# Altium project CW308T-FE310-G002.PrjPcb
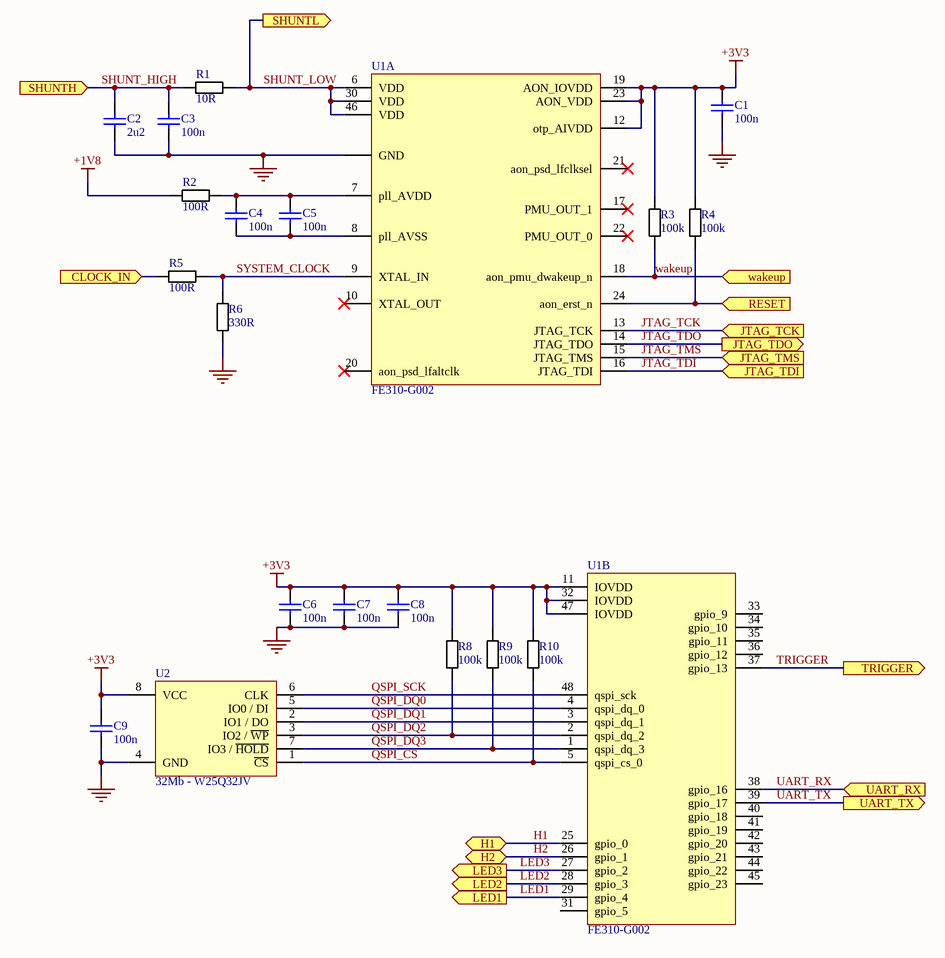
[diagram p0: CW308T-FE310-G002.SchDoc]
PrjLicense: GPL; PrjName: FE310-G002 Target; PrjRev: 02
2 sheets, 21 parts. Net scope: flat (ports and power ports of the same name join across sheets).
Board files: CW308T-FE310-G002.PcbDoc, FE310-G002-PANEL.PcbDoc
Sheets:
  CW308T-FE310-G002.SchDoc
  CW308T-FE310-G002-CONN.SchDoc

## Sheet CW308T-FE310-G002.SchDoc: FE310-G002 MCU and SPI
size Letter; SheetNumber: 1; SheetTotal: 2; SheetApproved: Yes

### Parts
C1  100n  [CAPC0603_M]
C2  2u2  [CAPC0603_M]
C3  100n  [CAPC0603_M]
C4  100n  [CAPC0603_M]
C5  100n  [CAPC0603_M]
C6  100n  [CAPC0603_M]
C7  100n  [CAPC0603_M]
C8  100n  [CAPC0603_M]
C9  100n  [CAPC0603_M]
R1  10R  [RESC1608X55N]
R2  100R  [RESC1608X55N]
R3  100k  [RESC1608X55N]
R4  100k  [RESC1608X55N]
R5  100R  [RESC1608X55N]
R6  330R  [RESC1608X55N]
R8  100k  [RESC1608X55N]
R9  100k  [RESC1608X55N]
R10  100k  [RESC1608X55N]
U1  FE310-G002  [QFN40P600X600X95_HS-49N]  (parts A,B of 2)
U2  32Mb - W25Q32JV  [SOIC127P790X216-8N]

### Ports
CLOCK_IN (in), H1 (bidir), H2 (bidir), JTAG_TCK (in), JTAG_TDI (in), JTAG_TDO (out), JTAG_TMS (in), LED1 (out), LED2 (out), LED3 (out), RESET (in), SHUNTH (in), SHUNTL (out), TRIGGER (out), UART_RX (in), UART_TX (out), wakeup (in)

### Nets
+1V8: R2.1
+3V3: C1.1 C6.1 C7.1 C8.1 C9.1 R3.1 R4.1 R8.1 R9.1 R10.1 U1.11(IOVDD) U1.12(otp_AIVDD) U1.19(AON_IOVDD) U1.23(AON_VDD) U1.32(IOVDD) U1.47(IOVDD) U2.8(VCC)
GND: C1.2 C2.2 C3.2 C6.2 C7.2 C8.2 C9.2 R6.2 U1.PAD(GND) U2.4(GND)
H1: U1.25(gpio_0) ; port H1
H2: U1.26(gpio_1) ; port H2
JTAG_TCK: U1.13(JTAG_TCK) ; port JTAG_TCK
JTAG_TDI: U1.16(JTAG_TDI) ; port JTAG_TDI
JTAG_TDO: U1.14(JTAG_TDO) ; port JTAG_TDO
JTAG_TMS: U1.15(JTAG_TMS) ; port JTAG_TMS
LED1: U1.29(gpio_4) ; port LED1
LED2: U1.28(gpio_3) ; port LED2
LED3: U1.27(gpio_2) ; port LED3
QSPI_CS: R10.2 U1.5(qspi_cs_0) U2.1(~{CS})
QSPI_DQ0: U1.4(qspi_dq_0) U2.5(IO0_/_DI)
QSPI_DQ1: U1.3(qspi_dq_1) U2.2(IO1_/_DO)
QSPI_DQ2: R8.2 U1.2(qspi_dq_2) U2.3(IO2_/_~{WP})
QSPI_DQ3: R9.2 U1.1(qspi_dq_3) U2.7(IO3_/_~{HOLD})
QSPI_SCK: U1.48(qspi_sck) U2.6(CLK)
RESET: R4.2 U1.24(aon_erst_n) ; port RESET
SHUNT_HIGH: C2.1 C3.1 R1.1 ; port SHUNTH
SHUNT_LOW: R1.2 U1.6(VDD) U1.30(VDD) U1.46(VDD) ; port SHUNTL
SYSTEM_CLOCK: R5.2 R6.1 U1.9(XTAL_IN)
TRIGGER: U1.37(gpio_13) ; port TRIGGER
UART_RX: U1.38(gpio_16) ; port UART_RX
UART_TX: U1.39(gpio_17) ; port UART_TX
wakeup: R3.2 U1.18(aon_pmu_dwakeup_n) ; port wakeup
NetC4_1: C4.1 C5.1 R2.2 U1.7(pll_AVDD)
NetC4_2: C4.2 C5.2 U1.8(pll_AVSS)
NetJ1_A3: R5.1 ; port CLOCK_IN

Not connected (* = marked no-connect by the designer): U1 10(XTAL_OUT)* 17(PMU_OUT_1)* 20(aon_psd_lfaltclk)* 21(aon_psd_lfclksel)* 22(PMU_OUT_0)* 31(gpio_5) 33(gpio_9) 34(gpio_10) 35(gpio_11) 36(gpio_12) 40(gpio_18) 41(gpio_19) 42(gpio_20) 43(gpio_21) 44(gpio_22) 45(gpio_23)

### Notes on the sheet
- Title:
- Date:
- Rev:
- Time:
- Project:
- Sheet
- of
- License:
- Copyright © NewAE Technology Inc.
- Approved:
- NewAE.com
- File:

### Library data of the parts
C1 C3-C9 = CCHIP-100n-0603: 100n, 0603; Manufacture 1: Kemet; Manufacture Part Number 1: C0603C104K5RACTU; Component Group: Capacitor; Case-EIA: 0603; Case-Metric: 1608; Rated Voltage: 50VDC; Part Number: CCHIP-100n-0603; Footprint: 0603; Pin Count: 2; Supplier 1: Digi-Key; Supplier Part Number 1: 399-5089-2-ND; Value: 100n; Mounting Technology: SMT; Component Kind: Standard; Component Type: Standard
C2 = CCHIP-2u2-0603: 2u2, 0603; Manufacture 1: Samsung; Manufacture Part Number 1: CL10B225KP8NNNC; Component Group: Capacitor; Case-EIA: 0603; Case-Metric: 1608; Rated Voltage: 10VDC; Part Number: CCHIP-2u2-0603; Footprint: 0603; Pin Count: 2; Supplier 1: Digi-Key; Supplier Part Number 1: 1276-1134-2-ND; Value: 2u2; Mounting Technology: SMT; Component Kind: Standard; Component Type: Standard
R1 = RCHIP-10R-0603: 10R res, 0603, 1%, 1/10W; Manufacture 1: Yageo; Manufacture Part Number 1: RC0603FR-0710RL; Component Group: Resistor; Case-EIA: 0603; Case-Metric: 1608; Rated Power: 0.1W; Rated Voltage: 75VDC; Part Number: RCHIP-10R-0603; Footprint: 0603; Pin Count: 2; Supplier 1: Digi-Key; Supplier Part Number 1: 311-10.0HRCT-ND; Value: 10R; Tolerance: 1%; Mounting Technology: SMT; Temperature Range: -55C to 155C; Component Kind: Standard; Component Type: Standard
R2 R5 = RCHIP-100R-0603: 100R res, 0603, 1%, 1/10W; Manufacture 1: Yageo; Manufacture Part Number 1: RC0603FR-07100RL; Component Group: Resistor; Case-EIA: 0603; Case-Metric: 1608; Rated Power: 0.1W; Rated Voltage: 75VDC; Part Number: RCHIP-100R-0603; Footprint: 0603; Pin Count: 2; Supplier 1: Digi-Key; Supplier Part Number 1: 311-100HRCT-ND; Value: 100R; Tolerance: 1%; Mounting Technology: SMT; Temperature Range: -55C to 155C; Component Kind: Standard; Component Type: Standard
R3 R4 R8-R10 = RCHIP-100K-0603: 100k res, 0603, 1%, 1/10W; Manufacture 1: Yageo; Manufacture Part Number 1: RC0603FR-07100KL; Component Group: Resistor; Case-EIA: 0603; Case-Metric: 1608; Rated Power: 0.1W; Rated Voltage: 75VDC; Part Number: RCHIP-100K-0603; Footprint: 0603; Pin Count: 2; Supplier 1: Digi-Key; Supplier Part Number 1: 311-100KHRCT-ND; Value: 100k; Tolerance: 1%; Mounting Technology: SMT; Temperature Range: -55C to 155C; Component Kind: Standard; Component Type: Standard
R6 = RCHIP-330R-0603: 330R res, 0603, 1%, 1/10W; Manufacture 1: Yageo; Manufacture Part Number 1: RC0603FR-07330RL; Component Group: Resistor; Case-EIA: 0603; Case-Metric: 1608; Rated Power: 0.1W; Rated Voltage: 75VDC; Part Number: RCHIP-330R-0603; Footprint: 0603; Pin Count: 2; Supplier 1: Digi-Key; Supplier Part Number 1: 311-330HRCT-ND; Value: 330R; Tolerance: 1%; Mounting Technology: SMT; Temperature Range: -55C to 155C; Component Kind: Standard; Component Type: Standard
U1 = FE310-G002: RISC-V FREEDOM SoC; Manufacture 1: SiFive; Component Group: Digital IC; PP Material Stack: 0; Part Number: FE310-G002; Footprint: QFN-48; Manufacture Part Number 1: FE310-G002; Pin Count: 48; Mounting Technology: SMT; Component Kind: Standard; Component Type: Standard; PP Rotation: 0
U2 = QSPI-FLASH-32M-32Mb: IC FLASH 32M SPI 133MHZ 8SOIC; Manufacture 1: Winbond Electronics; Manufacture Part Number 1: W25Q32JVSSIQ TR; Component Group: Digital IC; PP Material Stack: 0; Part Number: QSPI-FLASH-32M-32Mb; Footprint: 8SOIC; Pin Count: 8; Supplier 1: Digi-Key; Supplier Part Number 1: W25Q32JVSSIQCT-ND; Value: 32Mb; Mounting Technology: SMT; RoHS: Yes; Component Kind: Standard; Component Type: Standard; PP Rotation: 0

## Sheet CW308T-FE310-G002-CONN.SchDoc: CW308 Connections
size Letter; SheetNumber: 2; SheetTotal: 2; SheetApproved: NO
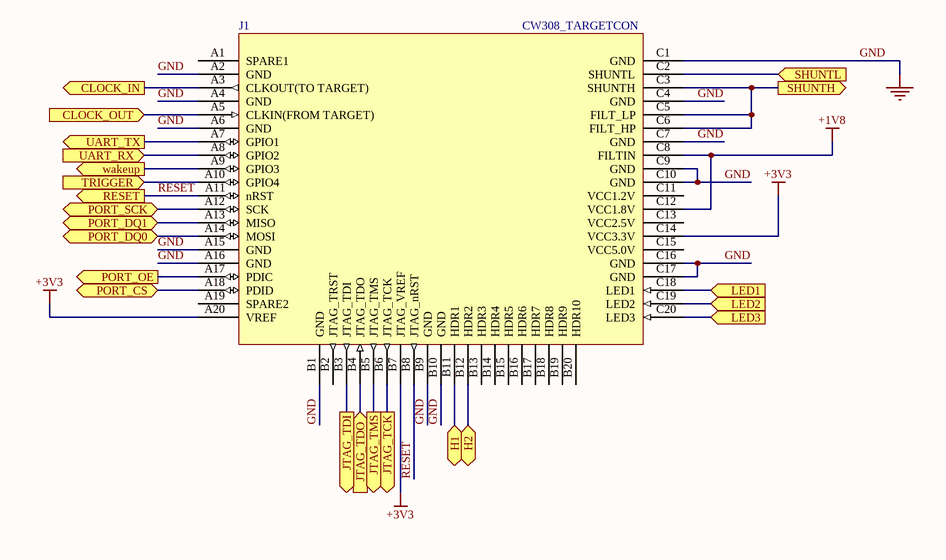
[diagram p1: CW308T-FE310-G002-CONN.SchDoc]

### Parts
J1  CW308_TARGETCON  [CW308_TBOARD_CONN]

### Ports
CLOCK_IN (out), CLOCK_OUT (in), H1 (bidir), H2 (bidir), JTAG_TCK (out), JTAG_TDI (out), JTAG_TDO (in), JTAG_TMS (out), LED1 (in), LED2 (in), LED3 (in), PORT_CS (bidir), PORT_DQ0 (bidir), PORT_DQ1 (bidir), PORT_OE (out), PORT_SCK (bidir), RESET (out), SHUNTH (out), SHUNTL (in), TRIGGER (in), UART_RX (in), UART_TX (out), wakeup (out)

### Nets
+1V8: J1.C8(FILTIN) J1.C12(VCC1.8V)
+3V3: J1.A20(VREF) J1.B7(JTAG_VREF) J1.C14(VCC3.3V)
GND: J1.A2(GND) J1.A4(GND) J1.A6(GND) J1.A15(GND) J1.A16(GND) J1.B1(GND) J1.B9(GND) J1.B10(GND) J1.C1(GND) J1.C4(GND) J1.C7(GND) J1.C9(GND) J1.C10(GND) J1.C16(GND) J1.C17(GND)
H1: J1.B11(HDR1) ; port H1
H2: J1.B12(HDR2) ; port H2
JTAG_TCK: J1.B6(JTAG_TCK) ; port JTAG_TCK
JTAG_TDI: J1.B3(JTAG_TDI) ; port JTAG_TDI
JTAG_TDO: J1.B4(JTAG_TDO) ; port JTAG_TDO
JTAG_TMS: J1.B5(JTAG_TMS) ; port JTAG_TMS
LED1: J1.C18(LED1) ; port LED1
LED2: J1.C19(LED2) ; port LED2
LED3: J1.C20(LED3) ; port LED3
RESET: J1.A11(nRST) J1.B8(JTAG_nRST) ; port RESET
SHUNT_HIGH: J1.C3(SHUNTH) J1.C5(FILT_LP) J1.C6(FILT_HP) ; port SHUNTH
SHUNT_LOW: J1.C2(SHUNTL) ; port SHUNTL
TRIGGER: J1.A10(GPIO4) ; port TRIGGER
UART_RX: J1.A8(GPIO2) ; port UART_RX
UART_TX: J1.A7(GPIO1) ; port UART_TX
wakeup: J1.A9(GPIO3) ; port wakeup
NetJ1_A3: J1.A3(CLKOUT(TO_TARGET)) ; port CLOCK_IN
NetJ1_A5: J1.A5(CLKIN(FROM_TARGET)) ; port CLOCK_OUT
NetJ1_A12: J1.A12(SCK) ; port PORT_SCK
NetJ1_A13: J1.A13(MISO) ; port PORT_DQ1
NetJ1_A14: J1.A14(MOSI) ; port PORT_DQ0
NetJ1_A17: J1.A17(PDIC) ; port PORT_OE
NetJ1_A18: J1.A18(PDID) ; port PORT_CS

Not connected (* = marked no-connect by the designer): J1 A1(SPARE1) A19(SPARE2) B2(JTAG_TRST) B13(HDR3) B14(HDR4) B15(HDR5) B16(HDR6) B17(HDR7) B18(HDR8) B19(HDR9) B20(HDR10) C11(VCC1.2V) C13(VCC2.5V) C15(VCC5.0V)

### Notes on the sheet
- Title:
- Date:
- Rev:
- Time:
- Project:
- Sheet
- of
- License:
- Copyright © NewAE Technology Inc.
- Approved:
- NewAE.com
- File:

### Library data of the parts
J1 = CW308_TBOARD: CW308 "Standard" Target Board Connector; Component Group: Mechanical; Pitch: 2.54mm; Part Number: CW308_TBOARD; Pin Count: 60; Mounting Technology: Through-hole; Component Kind: Standard; Component Type: Standard

## Nets that join several sheets
+1V8: CW308T-FE310-G002 (R2.1), CW308T-FE310-G002-CONN (J1.C8 J1.C12)
+3V3: CW308T-FE310-G002 (17 pins), CW308T-FE310-G002-CONN (J1.A20 J1.B7 J1.C14)
GND: CW308T-FE310-G002 (10 pins), CW308T-FE310-G002-CONN (15 pins)
H1: CW308T-FE310-G002 (U1.25), CW308T-FE310-G002-CONN (J1.B11)
H2: CW308T-FE310-G002 (U1.26), CW308T-FE310-G002-CONN (J1.B12)
JTAG_TCK: CW308T-FE310-G002 (U1.13), CW308T-FE310-G002-CONN (J1.B6)
JTAG_TDI: CW308T-FE310-G002 (U1.16), CW308T-FE310-G002-CONN (J1.B3)
JTAG_TDO: CW308T-FE310-G002 (U1.14), CW308T-FE310-G002-CONN (J1.B4)
JTAG_TMS: CW308T-FE310-G002 (U1.15), CW308T-FE310-G002-CONN (J1.B5)
LED1: CW308T-FE310-G002 (U1.29), CW308T-FE310-G002-CONN (J1.C18)
LED2: CW308T-FE310-G002 (U1.28), CW308T-FE310-G002-CONN (J1.C19)
LED3: CW308T-FE310-G002 (U1.27), CW308T-FE310-G002-CONN (J1.C20)
NetJ1_A3: CW308T-FE310-G002 (R5.1), CW308T-FE310-G002-CONN (J1.A3)
RESET: CW308T-FE310-G002 (R4.2 U1.24), CW308T-FE310-G002-CONN (J1.A11 J1.B8)
SHUNT_HIGH: CW308T-FE310-G002 (C2.1 C3.1 R1.1), CW308T-FE310-G002-CONN (J1.C3 J1.C5 J1.C6)
SHUNT_LOW: CW308T-FE310-G002 (R1.2 U1.6 U1.30 U1.46), CW308T-FE310-G002-CONN (J1.C2)
TRIGGER: CW308T-FE310-G002 (U1.37), CW308T-FE310-G002-CONN (J1.A10)
UART_RX: CW308T-FE310-G002 (U1.38), CW308T-FE310-G002-CONN (J1.A8)
UART_TX: CW308T-FE310-G002 (U1.39), CW308T-FE310-G002-CONN (J1.A7)
wakeup: CW308T-FE310-G002 (R3.2 U1.18), CW308T-FE310-G002-CONN (J1.A9)